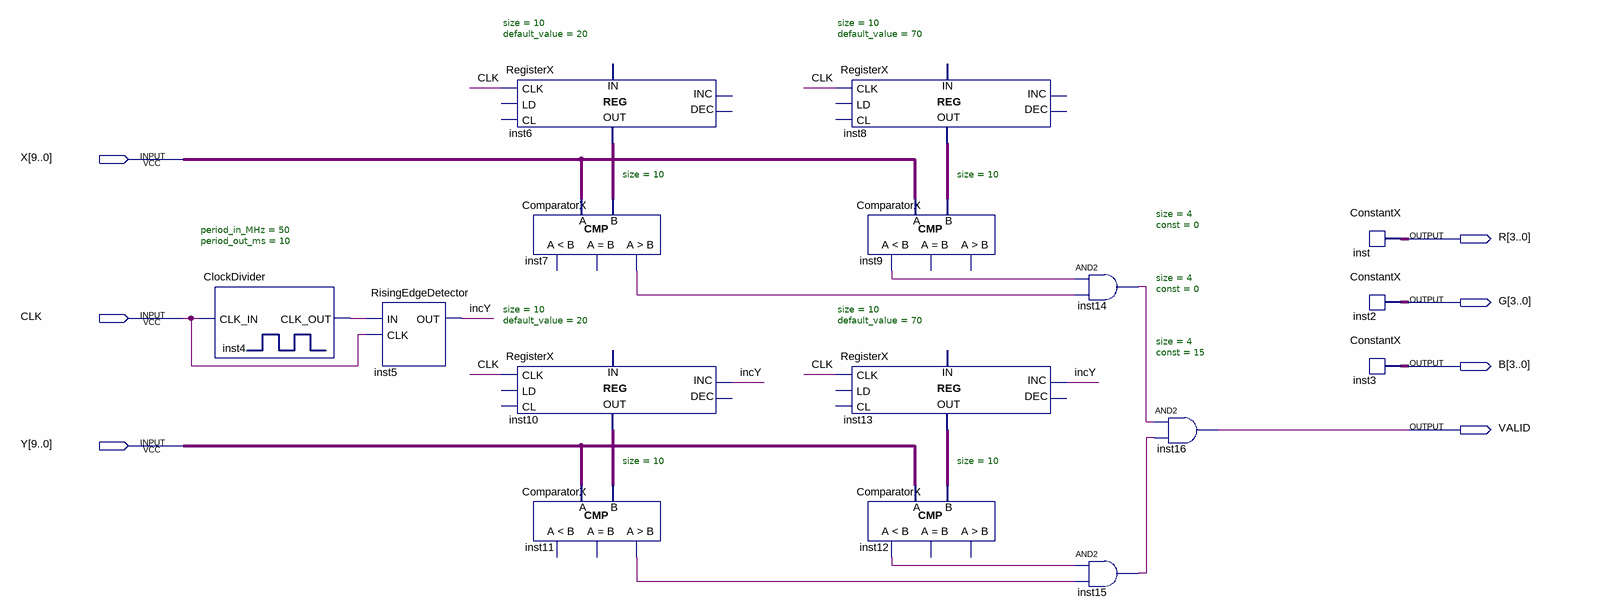
[diagram p0: schematic sheet]
// Quartus schematic Layer1.bdf as structural Verilog: 16 symbols, 7 pins
module Layer1 (
  input  [9:0] X,
  input  CLK,
  input  [9:0] Y,
  output [3:0] R,
  output [3:0] G,
  output [3:0] B,
  output VALID
);

  wire incY, inst4_clk_out, inst7_gr, inst9_ls, inst11_gr, inst12_ls, inst14_out, inst15_out;
  wire [9:0] inst6_data_out, inst8_data_out, inst10_data_out, inst13_data_out;

  ClockDivider #(.period_in_MHz(50), .period_out_ms(10)) inst4 (.CLK_IN(CLK), .CLK_OUT(inst4_clk_out));
  RisingEdgeDetector inst5 (.IN(inst4_clk_out), .CLK(CLK), .OUT(incY));
  RegisterX #(.size(10), .default_value(20)) inst6 (
    .CLK(CLK), .DATA_OUT(inst6_data_out));  // open: LD, CL, INC, DEC, DATA_IN
  ComparatorX #(.size(10)) inst7 (.A(X), .B(inst6_data_out), .GR(inst7_gr));  // open: LS, EQ
  RegisterX #(.size(10), .default_value(20)) inst10 (
    .CLK(CLK), .INC(incY), .DATA_OUT(inst10_data_out));  // open: LD, CL, DEC, DATA_IN
  ComparatorX #(.size(10)) inst11 (.A(Y), .B(inst10_data_out), .GR(inst11_gr));  // open: LS, EQ
  RegisterX #(.size(10), .default_value(70)) inst8 (
    .CLK(CLK), .DATA_OUT(inst8_data_out));  // open: LD, CL, INC, DEC, DATA_IN
  ComparatorX #(.size(10)) inst9 (.A(X), .B(inst8_data_out), .LS(inst9_ls));  // open: EQ, GR
  RegisterX #(.size(10), .default_value(70)) inst13 (
    .CLK(CLK), .INC(incY), .DATA_OUT(inst13_data_out));  // open: LD, CL, DEC, DATA_IN
  ComparatorX #(.size(10)) inst12 (.A(Y), .B(inst13_data_out), .LS(inst12_ls));  // open: EQ, GR
  and inst14 (inst14_out, inst9_ls, inst7_gr);
  and inst15 (inst15_out, inst12_ls, inst11_gr);
  and inst16 (VALID, inst14_out, inst15_out);
  ConstantX #(.size(4), .\const (0)) inst (.DATA_OUT(R));
  ConstantX #(.size(4), .\const (0)) inst2 (.DATA_OUT(G));
  ConstantX #(.size(4), .\const (15)) inst3 (.DATA_OUT(B));
endmodule
